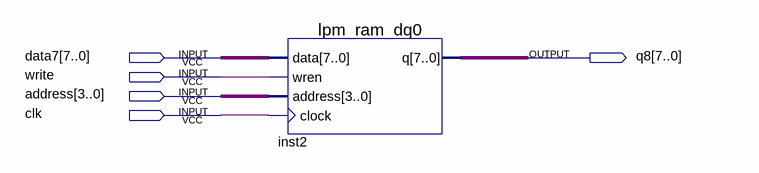
[diagram p0: schematic sheet]
// Quartus schematic ram.bdf as structural Verilog: 1 symbols, 5 pins
module ram (
  input  [7:0] data7,
  input  write,
  input  [3:0] address,
  input  clk,
  output [7:0] q8
);

  lpm_ram_dq0 inst2 (.data(data7), .wren(write), .address(address), .clock(clk), .q(q8));
endmodule
